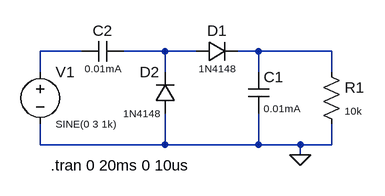
[diagram p0: schematic voltage multiplier 2.asc]
voltage multiplier 2.asc, the LTspice schematic file:
Version 4.1
SHEET 1 880 680
WIRE 48 80 -16 80
WIRE 176 80 112 80
WIRE 224 80 176 80
WIRE 320 80 288 80
WIRE 432 80 320 80
WIRE -16 112 -16 80
WIRE 176 112 176 80
WIRE 320 112 320 80
WIRE 432 112 432 80
WIRE -16 224 -16 192
WIRE 176 224 176 176
WIRE 176 224 -16 224
WIRE 320 224 320 176
WIRE 320 224 176 224
WIRE 384 224 320 224
WIRE 432 224 432 192
WIRE 432 224 384 224
WIRE 384 240 384 224
FLAG 384 240 0
SYMBOL voltage -16 96 R0
WINDOW 3 24 96 Left 1
WINDOW 123 0 0 Left 0
WINDOW 39 0 0 Left 0
SYMATTR InstName V1
SYMATTR Value SINE(0 3 1k)
SYMBOL res 416 96 R0
WINDOW 3 36 76 Left 1
SYMATTR InstName R1
SYMATTR Value 10k
SYMBOL cap 304 112 R0
WINDOW 3 24 56 Left 1
SYMATTR InstName C1
SYMATTR Value 0.01mA
SYMBOL cap 112 64 R90
WINDOW 0 0 32 VBottom 2
WINDOW 3 32 32 VTop 1
SYMATTR InstName C2
SYMATTR Value 0.01mA
SYMBOL diode 224 96 R270
WINDOW 0 32 32 VTop 2
WINDOW 3 0 32 VBottom 1
SYMATTR InstName D1
SYMATTR Value 1N4148
SYMBOL diode 192 176 R180
WINDOW 0 24 64 Left 2
WINDOW 3 24 0 Left 1
SYMATTR InstName D2
SYMATTR Value 1N4148
TEXT 0 256 Left 2 !.tran 0 20ms 0 10us

The netlist it stands for:
* voltage multiplier 2.asc
V1 N001 0 SINE(0 3 1k)
R1 N003 0 10k
C1 N003 0 0.01mA
C2 N002 N001 0.01mA
D1 N002 N003 1N4148
D2 0 N002 1N4148
.model D D
.lib standard.dio
.tran 0 20ms 0 10us
.backanno
.end